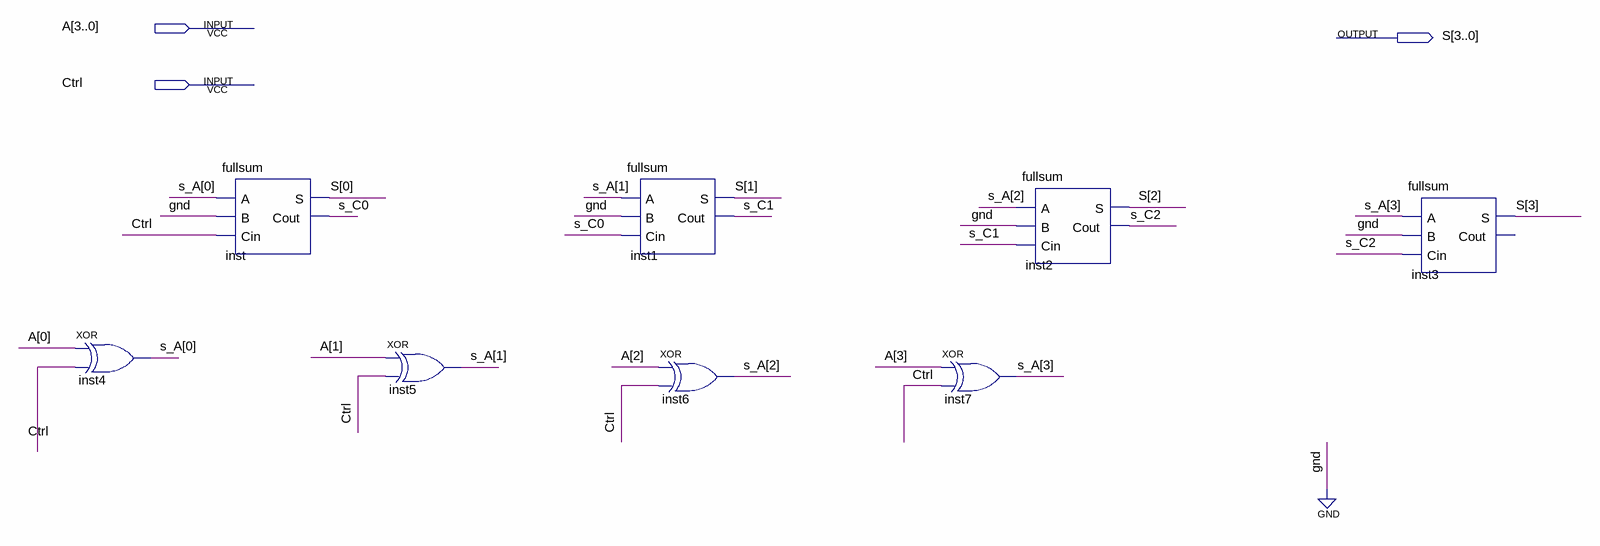
[diagram p0: schematic sheet]
// Quartus schematic complemento2.bdf as structural Verilog: 8 symbols, 3 pins
module complemento2 (
  input  [3:0] A,
  input  Ctrl,
  output [3:0] S
);

  wire s_C0, s_C1, s_C2;
  wire [3:0] s_A;

  xor inst4 (s_A[0], A[0], Ctrl);
  fullsum inst (.A(s_A[0]), .B(1'b0), .Cin(Ctrl), .S(S[0]), .Cout(s_C0));
  xor inst5 (s_A[1], A[1], Ctrl);
  fullsum inst1 (.A(s_A[1]), .B(1'b0), .Cin(s_C0), .S(S[1]), .Cout(s_C1));
  xor inst6 (s_A[2], A[2], Ctrl);
  xor inst7 (s_A[3], A[3], Ctrl);
  fullsum inst2 (.A(s_A[2]), .B(1'b0), .Cin(s_C1), .S(S[2]), .Cout(s_C2));
  fullsum inst3 (.A(s_A[3]), .B(1'b0), .Cin(s_C2), .S(S[3]));  // open: Cout
endmodule
